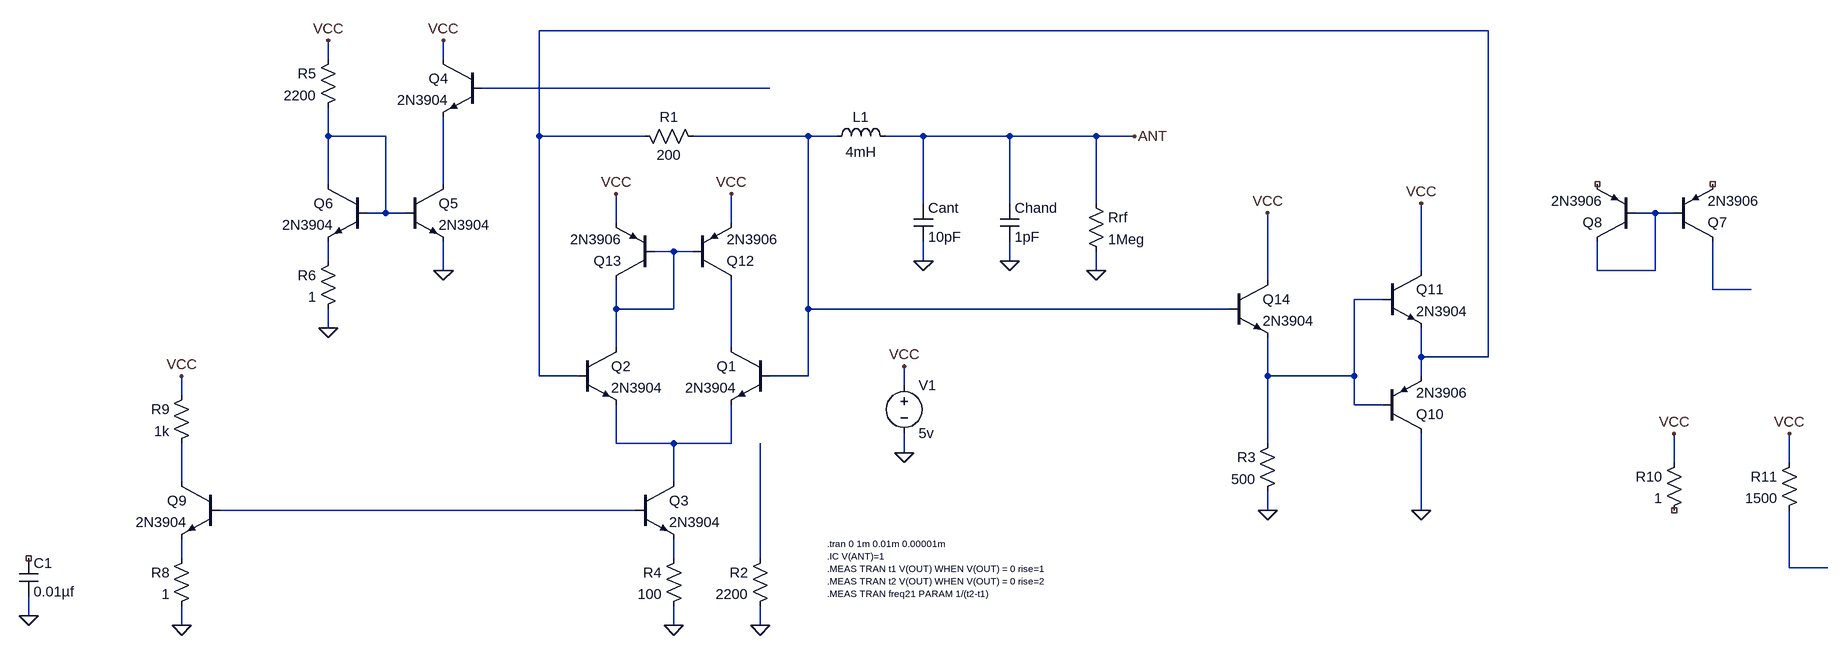
[diagram p0: schematic diff_osc_dewster_2020-11-15_experiments_v4.asc]
diff_osc_dewster_2020-11-15_experiments_v4.asc, the LTspice schematic file:
Version 4
SHEET 1 2908 996
WIRE 1712 -208 112 -208
WIRE -240 -160 -240 -192
WIRE -48 -160 -48 -192
WIRE 496 -112 16 -112
WIRE -240 -32 -240 -80
WIRE -144 -32 -240 -32
WIRE 112 -32 112 -208
WIRE 288 -32 112 -32
WIRE 560 -32 368 -32
WIRE 608 -32 560 -32
WIRE 752 -32 688 -32
WIRE 896 -32 752 -32
WIRE 1040 -32 896 -32
WIRE 1104 -32 1040 -32
WIRE -240 48 -240 -32
WIRE -48 48 -48 -64
WIRE 752 80 752 -32
WIRE 896 80 896 -32
WIRE 1040 80 1040 -32
WIRE -144 96 -144 -32
WIRE -144 96 -176 96
WIRE -112 96 -144 96
WIRE 2048 96 2016 96
WIRE 2080 96 2048 96
WIRE 240 112 240 64
WIRE 432 112 432 64
WIRE 336 160 304 160
WIRE 368 160 336 160
WIRE -240 176 -240 144
WIRE 752 176 752 144
WIRE 896 176 896 144
WIRE -48 192 -48 144
WIRE 1040 192 1040 160
WIRE 1600 192 1600 80
WIRE 1952 192 1952 144
WIRE 2048 192 2048 96
WIRE 2048 192 1952 192
WIRE 1344 208 1344 96
WIRE 2144 224 2144 144
WIRE 2208 224 2144 224
WIRE 1536 240 1488 240
WIRE 240 256 240 208
WIRE 336 256 336 160
WIRE 336 256 240 256
WIRE 560 256 560 -32
WIRE 1280 256 560 256
WIRE -240 288 -240 256
WIRE 240 320 240 256
WIRE 432 320 432 208
WIRE 1600 336 1600 288
WIRE 1712 336 1712 -208
WIRE 1712 336 1600 336
WIRE 112 368 112 -32
WIRE 176 368 112 368
WIRE 560 368 560 256
WIRE 560 368 496 368
WIRE 1344 368 1344 304
WIRE 1488 368 1488 240
WIRE 1488 368 1344 368
WIRE 1600 368 1600 336
WIRE 720 384 720 352
WIRE -656 400 -656 368
WIRE 1488 416 1488 368
WIRE 1536 416 1488 416
WIRE 240 480 240 416
WIRE 336 480 240 480
WIRE 432 480 432 416
WIRE 432 480 336 480
WIRE 1344 480 1344 368
WIRE 720 496 720 464
WIRE 2080 512 2080 464
WIRE 2272 512 2272 464
WIRE -656 544 -656 480
WIRE 336 544 336 480
WIRE 272 592 -592 592
WIRE 1344 592 1344 560
WIRE 1600 592 1600 464
WIRE -656 672 -656 640
WIRE 336 672 336 640
WIRE 480 672 480 480
WIRE 2272 688 2272 592
WIRE 2336 688 2272 688
WIRE -1024 768 -1024 736
WIRE -656 784 -656 752
WIRE 336 784 336 752
WIRE 480 784 480 752
FLAG 720 496 0
FLAG 720 352 VCC
FLAG 1104 -32 ANT
FLAG 752 176 0
FLAG 1040 192 0
FLAG -48 192 0
FLAG -240 -192 VCC
FLAG -240 288 0
FLAG 336 784 0
FLAG -1024 768 0
FLAG -48 -192 VCC
FLAG 240 64 VCC
FLAG 432 64 VCC
FLAG 480 784 0
FLAG -656 784 0
FLAG -656 368 VCC
FLAG 1600 80 VCC
FLAG 1600 592 0
FLAG 896 176 0
FLAG 2080 464 VCC
FLAG 2272 464 VCC
FLAG 1344 592 0
FLAG 1344 96 VCC
SYMBOL res 384 -16 M270
WINDOW 0 32 56 VTop 2
WINDOW 3 0 56 VBottom 2
SYMATTR InstName R1
SYMATTR Value 200
SYMBOL voltage 720 368 R0
WINDOW 123 0 0 Left 2
WINDOW 39 0 0 Left 2
SYMATTR InstName V1
SYMATTR Value 5v
SYMBOL npn 176 320 R0
SYMATTR InstName Q2
SYMATTR Value 2N3904
SYMBOL ind 592 -16 R270
WINDOW 0 32 56 VTop 2
WINDOW 3 5 56 VBottom 2
SYMATTR InstName L1
SYMATTR Value 4mH
SYMATTR SpiceLine Rser=150 Cpar=1.2pF
SYMBOL cap 736 80 R0
SYMATTR InstName Cant
SYMATTR Value 10pF
SYMBOL npn 496 320 M0
SYMATTR InstName Q1
SYMATTR Value 2N3904
SYMBOL npn 16 -160 M0
SYMATTR InstName Q4
SYMATTR Value 2N3904
SYMBOL res 1024 64 R0
SYMATTR InstName Rrf
SYMATTR Value 1Meg
SYMBOL res -224 -176 M0
SYMATTR InstName R5
SYMATTR Value 2200
SYMBOL npn -112 48 R0
SYMATTR InstName Q5
SYMATTR Value 2N3904
SYMBOL npn -176 48 M0
SYMATTR InstName Q6
SYMATTR Value 2N3904
SYMBOL res -224 160 M0
SYMATTR InstName R6
SYMATTR Value 1
SYMBOL npn 272 544 R0
SYMATTR InstName Q3
SYMATTR Value 2N3904
SYMBOL res 352 656 M0
SYMATTR InstName R4
SYMATTR Value 100
SYMBOL cap -1040 672 R0
SYMATTR InstName C1
SYMATTR Value 0.01µf
SYMBOL pnp 2080 144 M180
SYMATTR InstName Q7
SYMATTR Value 2N3906
SYMBOL pnp 2016 144 R180
SYMATTR InstName Q8
SYMATTR Value 2N3906
SYMBOL res 496 656 M0
SYMATTR InstName R2
SYMATTR Value 2200
SYMBOL npn -592 544 M0
SYMATTR InstName Q9
SYMATTR Value 2N3904
SYMBOL res -640 656 M0
SYMATTR InstName R8
SYMATTR Value 1
SYMBOL res -640 384 M0
SYMATTR InstName R9
SYMATTR Value 1k
SYMBOL pnp 1536 464 M180
SYMATTR InstName Q10
SYMATTR Value 2N3906
SYMBOL npn 1536 192 R0
SYMATTR InstName Q11
SYMATTR Value 2N3904
SYMBOL cap 880 80 R0
SYMATTR InstName Chand
SYMATTR Value 1pF
SYMBOL res 2096 496 M0
SYMATTR InstName R10
SYMATTR Value 1
SYMBOL res 2288 496 M0
SYMATTR InstName R11
SYMATTR Value 1500
SYMBOL pnp 368 208 M180
SYMATTR InstName Q12
SYMATTR Value 2N3906
SYMBOL pnp 304 208 R180
SYMATTR InstName Q13
SYMATTR Value 2N3906
SYMBOL npn 1280 208 R0
SYMATTR InstName Q14
SYMATTR Value 2N3904
SYMBOL res 1360 464 M0
SYMATTR InstName R3
SYMATTR Value 500
TEXT 592 648 Left 1 !.tran 0 1m 0.01m 0.00001m\n.IC V(ANT)=1\n.MEAS TRAN t1 V(OUT) WHEN V(OUT) = 0 rise=1\n.MEAS TRAN t2 V(OUT) WHEN V(OUT) = 0 rise=2\n.MEAS TRAN freq21 PARAM 1/(t2-t1)

The netlist it stands for:
* diff_osc_dewster_2020-11-15_experiments_v4.asc
R1 N004 N001 200
V1 VCC 0 5v
Q2 N007 N001 N012 0 2N3904
L1 N004 ANT 4mH Rser=150 Cpar=1.2pF
Cant ANT 0 10pF
Q1 N011 N004 N012 0 2N3904
Q4 VCC N002 N005 0 2N3904
Rrf ANT 0 1Meg
R5 VCC N003 2200
Q5 N005 N003 0 0 2N3904
Q6 N003 N003 N008 0 2N3904
R6 N008 0 1
Q3 N012 N014 N016 0 2N3904
R4 N016 0 100
C1 NC_01 0 0.01µf
Q7 N009 N006 NC_02 0 2N3906
Q8 N006 N006 NC_03 0 2N3906
R2 N017 0 2200
Q9 N013 N014 N015 0 2N3904
R8 N015 0 1
R9 VCC N013 1k
Q10 0 N010 N001 0 2N3906
Q11 VCC N010 N001 0 2N3904
Chand ANT 0 1pF
R10 VCC NC_04 1
R11 VCC N018 1500
Q12 N011 N007 VCC 0 2N3906
Q13 N007 N007 VCC 0 2N3906
Q14 VCC N004 N010 0 2N3904
R3 N010 0 500
.model NPN NPN
.model PNP PNP
.lib standard.bjt
.tran 0 1m 0.01m 0.00001m
.IC V(ANT)=1
.MEAS TRAN t1 V(OUT) WHEN V(OUT) = 0 rise=1
.MEAS TRAN t2 V(OUT) WHEN V(OUT) = 0 rise=2
.MEAS TRAN freq21 PARAM 1/(t2-t1)
.backanno
.end